# Altium project Kasli-DIOT.PrjPCB (part 5 of 7)

## Sheet FPGA_SDRAM.SchDoc: Kasli-DIOT
size 420 x 297 mm; EDA_Number: ARTIQ; Projet: ARTIQ/SINARA; Author: G.Kasprowicz; CompanyName: WUT ISE; DrawnBy: F.Świtakowski; Organization: WUT ISE; Address1: PW ISE; Address2: Nowowiejska 15/19 00-665 Warsaw; Address3: gkasprow@gmail.com; DocumentNumber: 1; Revision: 1.0; SheetNumber: 2; SheetTotal: 16; ModifiedBy: -; CheckedDate: -; Title2: FPGA_SDRAM; DivGrp: WUT ISE; Designer: F.Świtakowski; ModifiedDate: -; ProjectName: Sensor Box
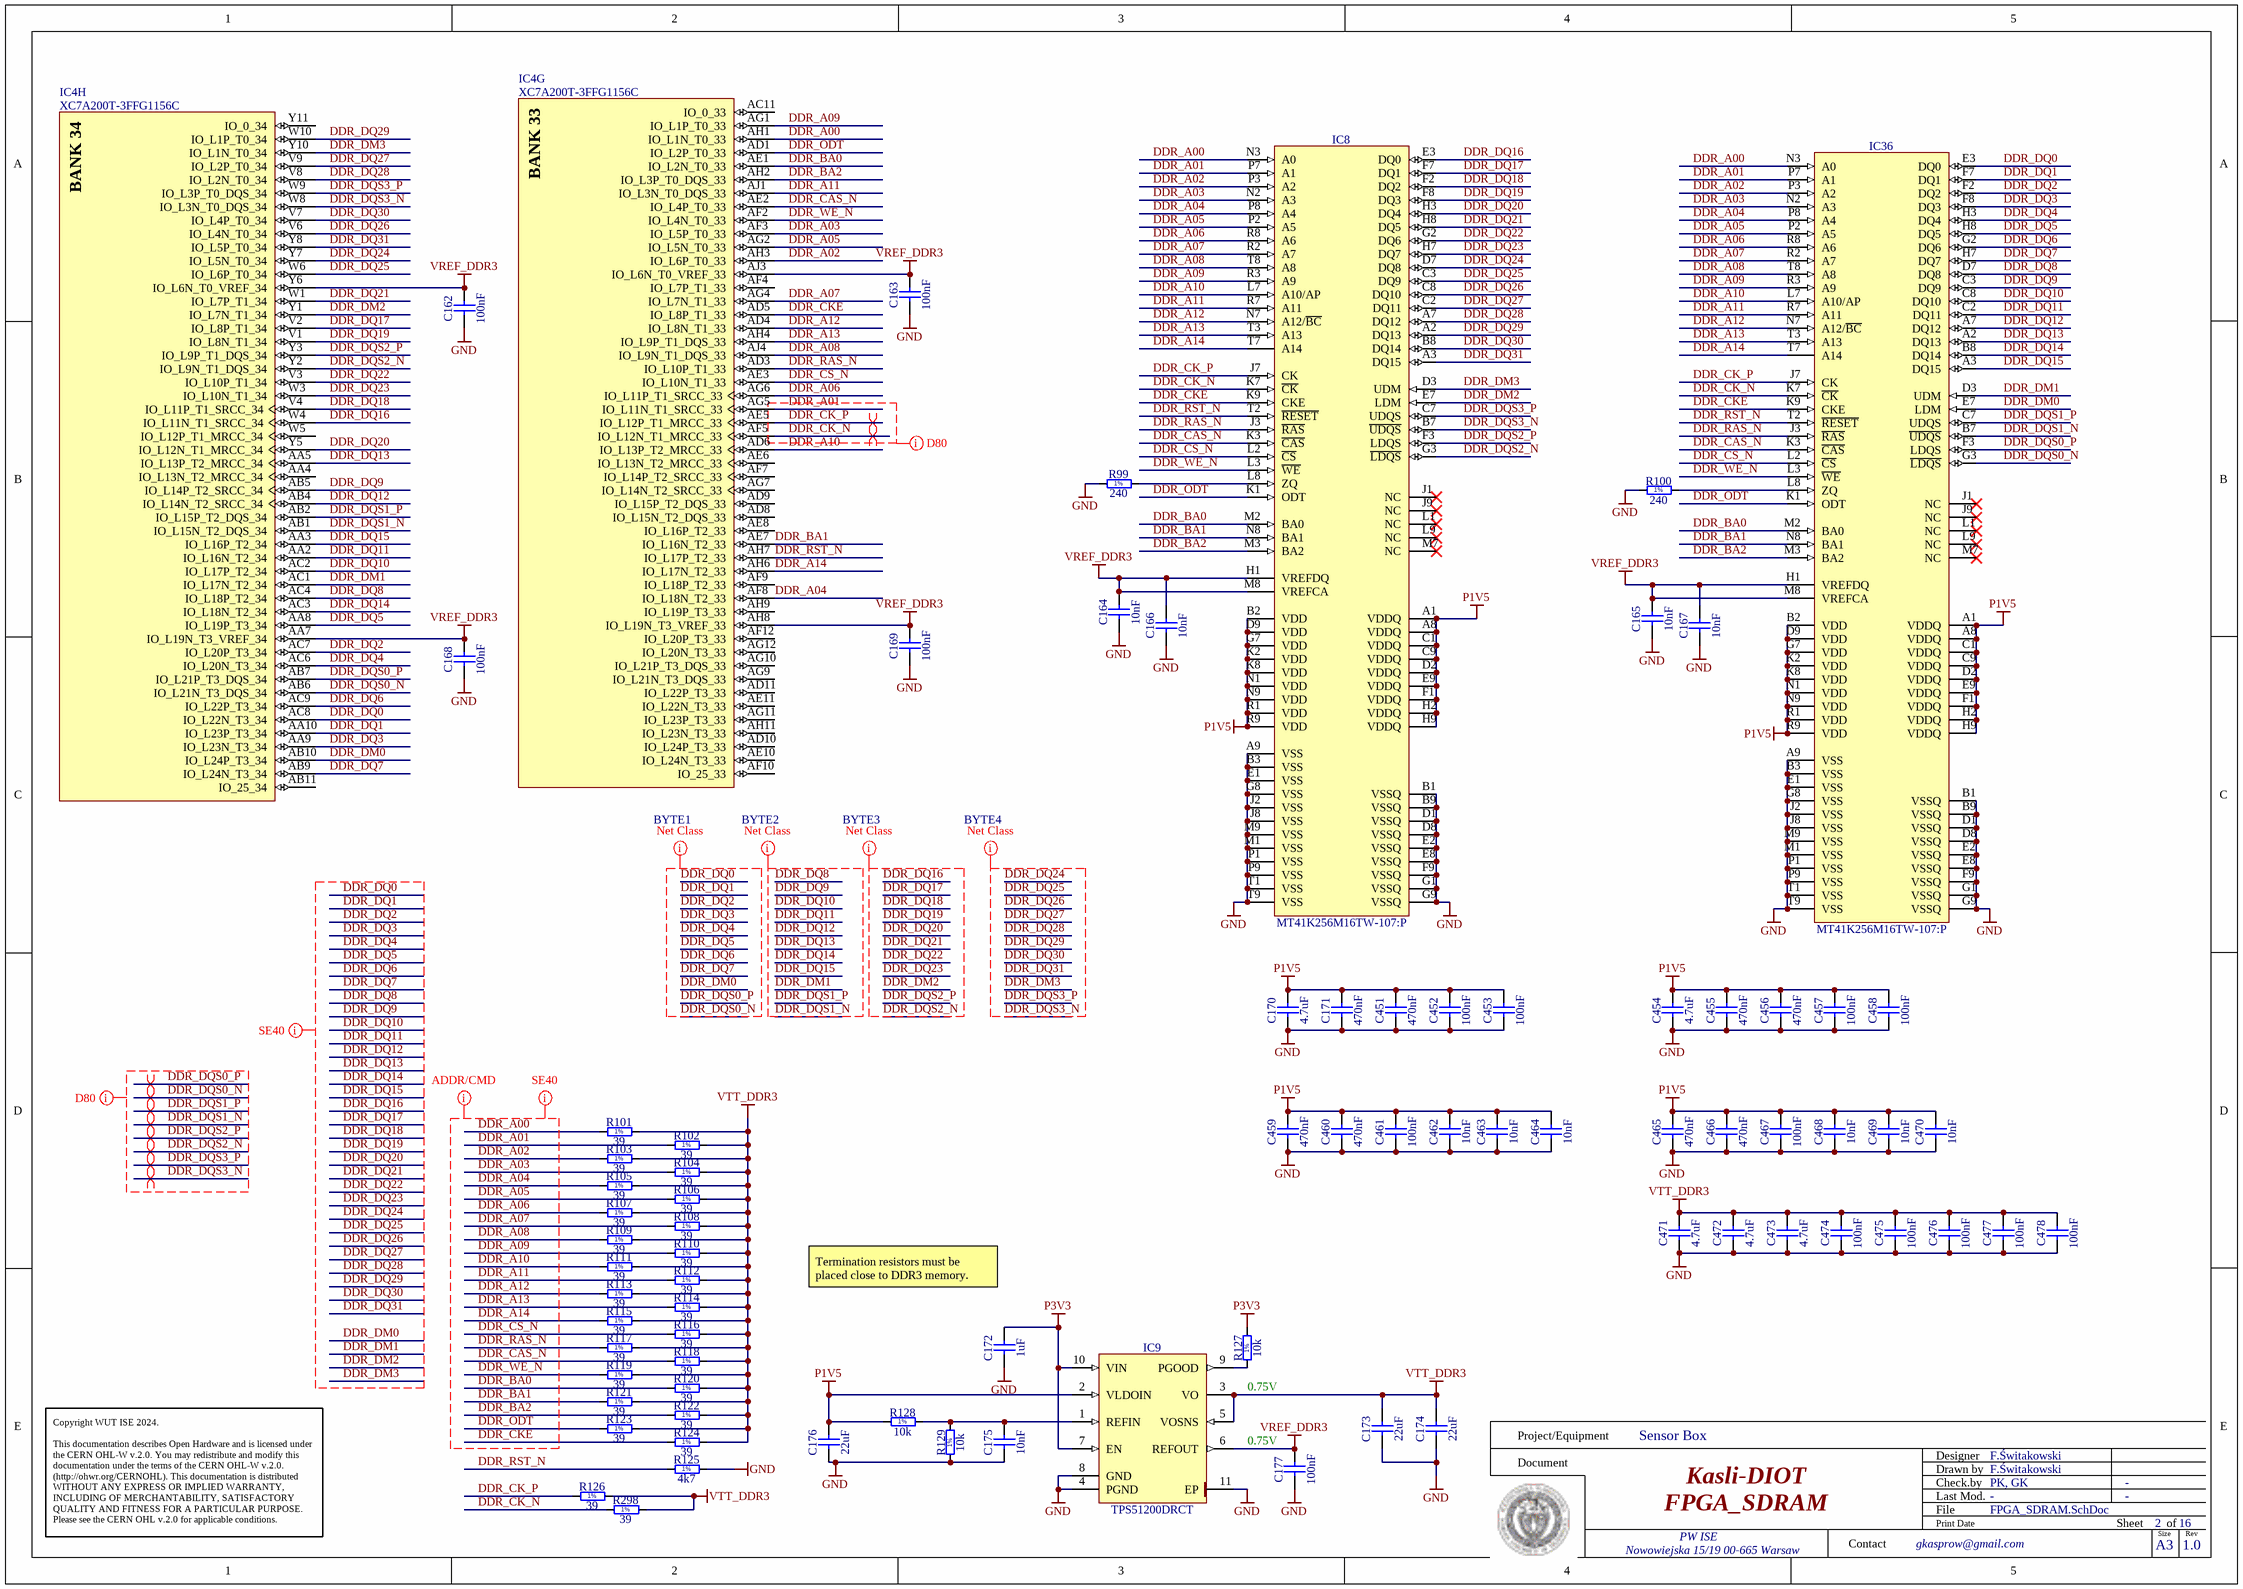
[diagram p6: FPGA_SDRAM.SchDoc]

### Parts
C162  100nF  [CAPC1005X55N]
C163  100nF  [CAPC1005X55N]
C164  10nF  [CAPC1005X55N]
C165  10nF  [CAPC1005X55N]
C166  10nF  [CAPC1005X55N]
C167  10nF  [CAPC1005X55N]
C168  100nF  [CAPC1005X55N]
C169  100nF  [CAPC1005X55N]
C170  4.7uF  [CAPC1005X55N]
C171  470nF  [CAPC1005X55N]
C172  1uF  [CAPC1005X55N]
C173  22uF  [CAPC1709X100N]
C174  22uF  [CAPC1709X100N]
C175  10nF  [CAPC1005X55N]
C176  22uF  [CAPC1709X100N]
C177  100nF  [CAPC1005X55N]
C451  470nF  [CAPC1005X55N]
C452  100nF  [CAPC1005X55N]
C453  100nF  [CAPC1005X55N]
C454  4.7uF  [CAPC1005X55N]
C455  470nF  [CAPC1005X55N]
C456  470nF  [CAPC1005X55N]
C457  100nF  [CAPC1005X55N]
C458  100nF  [CAPC1005X55N]
C459  470nF  [CAPC1005X55N]
C460  470nF  [CAPC1005X55N]
C461  100nF  [CAPC1005X55N]
C462  10nF  [CAPC1005X55N]
C463  10nF  [CAPC1005X55N]
C464  10nF  [CAPC1005X55N]
C465  470nF  [CAPC1005X55N]
C466  470nF  [CAPC1005X55N]
C467  100nF  [CAPC1005X55N]
C468  10nF  [CAPC1005X55N]
C469  10nF  [CAPC1005X55N]
C470  10nF  [CAPC1005X55N]
C471  4.7uF  [CAPC1005X55N]
C472  4.7uF  [CAPC1005X55N]
C473  4.7uF  [CAPC1005X55N]
C474  100nF  [CAPC1005X55N]
C475  100nF  [CAPC1005X55N]
C476  100nF  [CAPC1005X55N]
C477  100nF  [CAPC1005X55N]
C478  100nF  [CAPC1005X55N]
IC4  XC7A200T-3FFG1156C  [BGA1156C100P34X34_3500X3500X310]  (parts G,H of 18)
IC8  MT41K256M16TW-107:P  [BGA96C80P9X16_800X1400X120]
IC9  TPS51200DRCT  [TEXAS_DRC (S-PVSON-N10)]
IC36  MT41K256M16TW-107:P  [BGA96C80P9X16_800X1400X120]
R99  240  [RESC1005X40N]
R100  240  [RESC1005X40N]
R101  39  [RESC1005X40N]
R102  39  [RESC1005X40N]
R103  39  [RESC1005X40N]
R104  39  [RESC1005X40N]
R105  39  [RESC1005X40N]
R106  39  [RESC1005X40N]
R107  39  [RESC1005X40N]
R108  39  [RESC1005X40N]
R109  39  [RESC1005X40N]
R110  39  [RESC1005X40N]
R111  39  [RESC1005X40N]
R112  39  [RESC1005X40N]
R113  39  [RESC1005X40N]
R114  39  [RESC1005X40N]
R115  39  [RESC1005X40N]
R116  39  [RESC1005X40N]
R117  39  [RESC1005X40N]
R118  39  [RESC1005X40N]
R119  39  [RESC1005X40N]
R120  39  [RESC1005X40N]
R121  39  [RESC1005X40N]
R122  39  [RESC1005X40N]
R123  39  [RESC1005X40N]
R124  39  [RESC1005X40N]
R125  4k7  [RESC1005X40N]
R126  39  [RESC1005X40N]
R127  10k  [RESC1005X40N]
R128  10k  [RESC1005X40N]
R129  10k  [RESC1005X40N]
R298  39  [RESC1005X40N]

### Nets
GND: C162.1 C163.1 C164.1 C165.1 C166.1 C167.1 C168.1 C169.1 C170.1 C171.1 C172.1 C173.1 C174.1 C175.1 C176.1 C177.1 C451.1 C452.1 C453.1 C454.1 C455.1 C456.1 C457.1 C458.1 C459.1 C460.1 C461.1 C462.1 C463.1 C464.1 C465.1 C466.1 C467.1 C468.1 C469.1 C470.1 C471.1 C472.1 C473.1 C474.1 C475.1 C476.1 C477.1 C478.1 IC8.A9(VSS) IC8.B1(VSSQ) IC8.B3(VSS) IC8.B9(VSSQ) IC8.D1(VSSQ) IC8.D8(VSSQ) IC8.E1(VSS) IC8.E2(VSSQ) IC8.E8(VSSQ) IC8.F9(VSSQ) IC8.G1(VSSQ) IC8.G8(VSS) IC8.G9(VSSQ) IC8.J2(VSS) IC8.J8(VSS) IC8.M1(VSS) IC8.M9(VSS) IC8.P1(VSS) IC8.P9(VSS) IC8.T1(VSS) IC8.T9(VSS) IC9.4(PGND) IC9.8(GND) IC9.11(EP) IC36.A9(VSS) IC36.B1(VSSQ) IC36.B3(VSS) IC36.B9(VSSQ) IC36.D1(VSSQ) IC36.D8(VSSQ) IC36.E1(VSS) IC36.E2(VSSQ) IC36.E8(VSSQ) IC36.F9(VSSQ) IC36.G1(VSSQ) IC36.G8(VSS) IC36.G9(VSSQ) IC36.J2(VSS) IC36.J8(VSS) IC36.M1(VSS) IC36.M9(VSS) IC36.P1(VSS) IC36.P9(VSS) IC36.T1(VSS) IC36.T9(VSS) R99.1 R100.1 R125.2 R129.1
P1V5: C170.2 C171.2 C176.2 C451.2 C452.2 C453.2 C454.2 C455.2 C456.2 C457.2 C458.2 C459.2 C460.2 C461.2 C462.2 C463.2 C464.2 C465.2 C466.2 C467.2 C468.2 C469.2 C470.2 IC8.A1(VDDQ) IC8.A8(VDDQ) IC8.B2(VDD) IC8.C1(VDDQ) IC8.C9(VDDQ) IC8.D2(VDDQ) IC8.D9(VDD) IC8.E9(VDDQ) IC8.F1(VDDQ) IC8.G7(VDD) IC8.H2(VDDQ) IC8.H9(VDDQ) IC8.K2(VDD) IC8.K8(VDD) IC8.N1(VDD) IC8.N9(VDD) IC8.R1(VDD) IC8.R9(VDD) IC9.2(VLDOIN) IC36.A1(VDDQ) IC36.A8(VDDQ) IC36.B2(VDD) IC36.C1(VDDQ) IC36.C9(VDDQ) IC36.D2(VDDQ) IC36.D9(VDD) IC36.E9(VDDQ) IC36.F1(VDDQ) IC36.G7(VDD) IC36.H2(VDDQ) IC36.H9(VDDQ) IC36.K2(VDD) IC36.K8(VDD) IC36.N1(VDD) IC36.N9(VDD) IC36.R1(VDD) IC36.R9(VDD) R128.1
P3V3: C172.2 IC9.7(EN) IC9.10(VIN) R127.2
VREF_DDR3: C162.2 C163.2 C164.2 C165.2 C166.2 C167.2 C168.2 C169.2 C177.2 IC4.AA7(IO_L19N_T3_VREF_34) IC4.AH8(IO_L19N_T3_VREF_33) IC4.AJ3(IO_L6N_T0_VREF_33) IC4.Y6(IO_L6N_T0_VREF_34) IC8.H1(VREFDQ) IC8.M8(VREFCA) IC9.6(REFOUT) IC36.H1(VREFDQ) IC36.M8(VREFCA)
VTT_DDR3: C173.2 C174.2 C471.2 C472.2 C473.2 C474.2 C475.2 C476.2 C477.2 C478.2 IC9.3(VO) IC9.5(VOSNS) R101.2 R102.2 R103.2 R104.2 R105.2 R106.2 R107.2 R108.2 R109.2 R110.2 R111.2 R112.2 R113.2 R114.2 R115.2 R116.2 R117.2 R118.2 R119.2 R120.2 R121.2 R122.2 R123.2 R124.2 R126.2 R298.2
DDR_A00: IC4.AH1(IO_L1N_T0_33) IC8.N3(A0) IC36.N3(A0) R101.1
DDR_A01: IC4.AG5(IO_L11N_T1_SRCC_33) IC8.P7(A1) IC36.P7(A1) R102.1
DDR_A02: IC4.AH3(IO_L6P_T0_33) IC8.P3(A2) IC36.P3(A2) R103.1
DDR_A03: IC4.AF3(IO_L5P_T0_33) IC8.N2(A3) IC36.N2(A3) R104.1
DDR_A04: IC4.AF8(IO_L18N_T2_33) IC8.P8(A4) IC36.P8(A4) R105.1
DDR_A05: IC4.AG2(IO_L5N_T0_33) IC8.P2(A5) IC36.P2(A5) R106.1
DDR_A06: IC4.AG6(IO_L11P_T1_SRCC_33) IC8.R8(A6) IC36.R8(A6) R107.1
DDR_A07: IC4.AG4(IO_L7N_T1_33) IC8.R2(A7) IC36.R2(A7) R108.1
DDR_A08: IC4.AJ4(IO_L9N_T1_DQS_33) IC8.T8(A8) IC36.T8(A8) R109.1
DDR_A09: IC4.AG1(IO_L1P_T0_33) IC8.R3(A9) IC36.R3(A9) R110.1
DDR_A10: IC4.AD6(IO_L13P_T2_MRCC_33) IC8.L7(A10/AP) IC36.L7(A10/AP) R111.1
DDR_A11: IC4.AJ1(IO_L3N_T0_DQS_33) IC8.R7(A11) IC36.R7(A11) R112.1
DDR_A12: IC4.AD4(IO_L8N_T1_33) IC8.N7(A12/~{BC}) IC36.N7(A12/~{BC}) R113.1
DDR_A13: IC4.AH4(IO_L9P_T1_DQS_33) IC8.T3(A13) IC36.T3(A13) R114.1
DDR_A14: IC4.AH6(IO_L17N_T2_33) IC8.T7(A14) IC36.T7(A14) R115.1
DDR_BA0: IC4.AE1(IO_L2N_T0_33) IC8.M2(BA0) IC36.M2(BA0) R120.1
DDR_BA1: IC4.AE7(IO_L16N_T2_33) IC8.N8(BA1) IC36.N8(BA1) R121.1
DDR_BA2: IC4.AH2(IO_L3P_T0_DQS_33) IC8.M3(BA2) IC36.M3(BA2) R122.1
DDR_CAS_N: IC4.AE2(IO_L4P_T0_33) IC8.K3(~{CAS}) IC36.K3(~{CAS}) R118.1
DDR_CK_N: IC4.AF5(IO_L12N_T1_MRCC_33) IC8.K7(~{CK}) IC36.K7(~{CK}) R298.1
DDR_CK_P: IC4.AE5(IO_L12P_T1_MRCC_33) IC8.J7(CK) IC36.J7(CK) R126.1
DDR_CKE: IC4.AD5(IO_L8P_T1_33) IC8.K9(CKE) IC36.K9(CKE) R124.1
DDR_CS_N: IC4.AE3(IO_L10N_T1_33) IC8.L2(~{CS}) IC36.L2(~{CS}) R116.1
DDR_DM0: IC4.AB10(IO_L24P_T3_34) IC36.E7(LDM)
DDR_DM1: IC4.AC1(IO_L17N_T2_34) IC36.D3(UDM)
DDR_DM2: IC4.Y1(IO_L7N_T1_34) IC8.E7(LDM)
DDR_DM3: IC4.Y10(IO_L1N_T0_34) IC8.D3(UDM)
DDR_DQ0: IC4.AC8(IO_L22N_T3_34) IC36.E3(DQ0)
DDR_DQ1: IC4.AA10(IO_L23P_T3_34) IC36.F7(DQ1)
DDR_DQ2: IC4.AC7(IO_L20P_T3_34) IC36.F2(DQ2)
DDR_DQ3: IC4.AA9(IO_L23N_T3_34) IC36.F8(DQ3)
DDR_DQ4: IC4.AC6(IO_L20N_T3_34) IC36.H3(DQ4)
DDR_DQ5: IC4.AA8(IO_L19P_T3_34) IC36.H8(DQ5)
DDR_DQ6: IC4.AC9(IO_L22P_T3_34) IC36.G2(DQ6)
DDR_DQ7: IC4.AB9(IO_L24N_T3_34) IC36.H7(DQ7)
DDR_DQ8: IC4.AC4(IO_L18P_T2_34) IC36.D7(DQ8)
DDR_DQ9: IC4.AB5(IO_L14P_T2_SRCC_34) IC36.C3(DQ9)
DDR_DQ10: IC4.AC2(IO_L17P_T2_34) IC36.C8(DQ10)
DDR_DQ11: IC4.AA2(IO_L16N_T2_34) IC36.C2(DQ11)
DDR_DQ12: IC4.AB4(IO_L14N_T2_SRCC_34) IC36.A7(DQ12)
DDR_DQ13: IC4.AA5(IO_L13P_T2_MRCC_34) IC36.A2(DQ13)
DDR_DQ14: IC4.AC3(IO_L18N_T2_34) IC36.B8(DQ14)
DDR_DQ15: IC4.AA3(IO_L16P_T2_34) IC36.A3(DQ15)
DDR_DQ16: IC4.W4(IO_L11N_T1_SRCC_34) IC8.E3(DQ0)
DDR_DQ17: IC4.V2(IO_L8P_T1_34) IC8.F7(DQ1)
DDR_DQ18: IC4.V4(IO_L11P_T1_SRCC_34) IC8.F2(DQ2)
DDR_DQ19: IC4.V1(IO_L8N_T1_34) IC8.F8(DQ3)
DDR_DQ20: IC4.Y5(IO_L12N_T1_MRCC_34) IC8.H3(DQ4)
DDR_DQ21: IC4.W1(IO_L7P_T1_34) IC8.H8(DQ5)
DDR_DQ22: IC4.V3(IO_L10P_T1_34) IC8.G2(DQ6)
DDR_DQ23: IC4.W3(IO_L10N_T1_34) IC8.H7(DQ7)
DDR_DQ24: IC4.Y7(IO_L5N_T0_34) IC8.D7(DQ8)
DDR_DQ25: IC4.W6(IO_L6P_T0_34) IC8.C3(DQ9)
DDR_DQ26: IC4.V6(IO_L4N_T0_34) IC8.C8(DQ10)
DDR_DQ27: IC4.V9(IO_L2P_T0_34) IC8.C2(DQ11)
DDR_DQ28: IC4.V8(IO_L2N_T0_34) IC8.A7(DQ12)
DDR_DQ29: IC4.W10(IO_L1P_T0_34) IC8.A2(DQ13)
DDR_DQ30: IC4.V7(IO_L4P_T0_34) IC8.B8(DQ14)
DDR_DQ31: IC4.Y8(IO_L5P_T0_34) IC8.A3(DQ15)
DDR_DQS0_N: IC4.AB6(IO_L21N_T3_DQS_34) IC36.G3(~{LDQS})
DDR_DQS0_P: IC4.AB7(IO_L21P_T3_DQS_34) IC36.F3(LDQS)
DDR_DQS1_N: IC4.AB1(IO_L15N_T2_DQS_34) IC36.B7(~{UDQS})
DDR_DQS1_P: IC4.AB2(IO_L15P_T2_DQS_34) IC36.C7(UDQS)
DDR_DQS2_N: IC4.Y2(IO_L9N_T1_DQS_34) IC8.G3(~{LDQS})
DDR_DQS2_P: IC4.Y3(IO_L9P_T1_DQS_34) IC8.F3(LDQS)
DDR_DQS3_N: IC4.W8(IO_L3N_T0_DQS_34) IC8.B7(~{UDQS})
DDR_DQS3_P: IC4.W9(IO_L3P_T0_DQS_34) IC8.C7(UDQS)
DDR_ODT: IC4.AD1(IO_L2P_T0_33) IC8.K1(ODT) IC36.K1(ODT) R123.1
DDR_RAS_N: IC4.AD3(IO_L10P_T1_33) IC8.J3(~{RAS}) IC36.J3(~{RAS}) R117.1
DDR_RST_N: IC4.AH7(IO_L17P_T2_33) IC8.T2(~{RESET}) IC36.T2(~{RESET}) R125.1
DDR_WE_N: IC4.AF2(IO_L4N_T0_33) IC8.L3(~{WE}) IC36.L3(~{WE}) R119.1
NetC175_2: C175.2 IC9.1(REFIN) R128.2 R129.2
NetIC8_L8: IC8.L8(ZQ) R99.2
NetIC9_9: IC9.9(PGOOD) R127.1
NetIC36_L8: IC36.L8(ZQ) R100.2

Not connected (* = marked no-connect by the designer): IC4 AA4(IO_L13N_T2_MRCC_34) AB11(IO_25_34) AC11(IO_0_33) AD8(IO_L15N_T2_DQS_33) AD9(IO_L15P_T2_DQS_33) AD10(IO_L24P_T3_33) AD11(IO_L22P_T3_33) AE6(IO_L13N_T2_MRCC_33) AE8(IO_L16P_T2_33) AE10(IO_L24N_T3_33) AE11(IO_L22N_T3_33) AF4(IO_L7P_T1_33) AF7(IO_L14P_T2_SRCC_33) AF9(IO_L18P_T2_33) AF10(IO_25_33) AF12(IO_L20P_T3_33) AG7(IO_L14N_T2_SRCC_33) AG9(IO_L21N_T3_DQS_33) AG10(IO_L21P_T3_DQS_33) AG11(IO_L23P_T3_33) AG12(IO_L20N_T3_33) AH9(IO_L19P_T3_33) AH11(IO_L23N_T3_33) W5(IO_L12P_T1_MRCC_34) Y11(IO_0_34); IC8 J1(NC)* J9(NC)* L1(NC)* L9(NC)* M7(NC)*; IC36 J1(NC)* J9(NC)* L1(NC)* L9(NC)* M7(NC)*

### Layout directives
net class BYTE1: DDR_DM0, DDR_DQ0, DDR_DQ1, DDR_DQ2, DDR_DQ3, DDR_DQ4, DDR_DQ5, DDR_DQ6, DDR_DQ7, DDR_DQS0_N, DDR_DQS0_P
net class ADDR/CMD: DDR_A00, DDR_A01, DDR_A02, DDR_A03, DDR_A04, DDR_A05, DDR_A06, DDR_A07, DDR_A08, DDR_A09, DDR_A10, DDR_A11, DDR_A12, DDR_A13, DDR_A14, DDR_BA0, DDR_BA1, DDR_BA2, DDR_CAS_N, DDR_CKE, DDR_CS_N, DDR_ODT, DDR_RAS_N, DDR_WE_N
net class SE40: DDR_A00, DDR_A01, DDR_A02, DDR_A03, DDR_A04, DDR_A05, DDR_A06, DDR_A07, DDR_A08, DDR_A09, DDR_A10, DDR_A11, DDR_A12, DDR_A13, DDR_A14, DDR_BA0, DDR_BA1, DDR_BA2, DDR_CAS_N, DDR_CKE, DDR_CS_N, DDR_DM0, DDR_DM1, DDR_DM2, DDR_DM3, DDR_DQ0, DDR_DQ1, DDR_DQ2, DDR_DQ3, DDR_DQ4, DDR_DQ5, DDR_DQ6, DDR_DQ7, DDR_DQ8, DDR_DQ9, DDR_DQ10, DDR_DQ11, DDR_DQ12, DDR_DQ13, DDR_DQ14, DDR_DQ15, DDR_DQ16, DDR_DQ17, DDR_DQ18, DDR_DQ19, DDR_DQ20, DDR_DQ21, DDR_DQ22, DDR_DQ23, DDR_DQ24, DDR_DQ25, DDR_DQ26, DDR_DQ27, DDR_DQ28, DDR_DQ29, DDR_DQ30, DDR_DQ31, DDR_ODT, DDR_RAS_N, DDR_WE_N
differential pair: DDR_CK_N, DDR_CK_P, DDR_DQS0_N, DDR_DQS0_P, DDR_DQS1_N, DDR_DQS1_P, DDR_DQS2_N, DDR_DQS2_P, DDR_DQS3_N, DDR_DQS3_P
net class D80: DDR_A01, DDR_CK_N, DDR_CK_P, DDR_DQS0_N, DDR_DQS0_P, DDR_DQS1_N, DDR_DQS1_P, DDR_DQS2_N, DDR_DQS2_P, DDR_DQS3_N, DDR_DQS3_P
net class BYTE2: DDR_DM1, DDR_DQ8, DDR_DQ9, DDR_DQ10, DDR_DQ11, DDR_DQ12, DDR_DQ13, DDR_DQ14, DDR_DQ15, DDR_DQS1_N, DDR_DQS1_P
net class BYTE3: DDR_DM2, DDR_DQ16, DDR_DQ17, DDR_DQ18, DDR_DQ19, DDR_DQ20, DDR_DQ21, DDR_DQ22, DDR_DQ23, DDR_DQS2_N, DDR_DQS2_P
net class BYTE4: DDR_DM3, DDR_DQ24, DDR_DQ25, DDR_DQ26, DDR_DQ27, DDR_DQ28, DDR_DQ29, DDR_DQ30, DDR_DQ31, DDR_DQS3_N, DDR_DQS3_P

### Notes on the sheet
- Termination resistors must be placed close to DDR3 memory.
- (near R127) 0.75V
- (near C177) 0.75V
- Project/Equipment
- Document
- Designer
- Drawn by
- Check.by
- Copyright WUT ISE 2024.
  This documentation describes Open Hardware and is licensed under the CERN OHL-W v.2.0. You may redistribute and modify this documentation under the terms of the CERN OHL-W v.2.0. (http://ohwr.org/CERNOHL). This documentation is distributed WITHOUT ANY EXPRESS OR IMPLIED WARRANTY, INCLUDING OF MERCHANTABILITY, SATISFACTORY QUALITY AND FITNESS FOR A PARTICULAR PURPOSE. Please see the CERN OHL v.2.0 for applicable conditions.
- Contact
- File
- Last Mod.
- Print Date
- Sheet
- Size
- A3
- of
- Rev
- (in symbol R0402_4K7_1%_0.0625W_100PPM) 1%
- (in symbol R0402_10K_1%_0.0625W_100PPM) 1%
- (in symbol R0402_39R_1%_0.0625W_100PPM) 1%
- (in symbol R0402_240R_1%_0.0625W_100PPM) 1%
- (in symbol XC7A200T-3FFG1156C, part G) BANK 33
- (in symbol XC7A200T-3FFG1156C, part H) BANK 34

### Library data of the parts
C162 C163 C168 C169 C177 C452 C453 C457 C458 C461 C467 C474-C478 = CC0402_100NF_16V_10%_X7R: as C160 on sheet SFP; Part Number: CC0402_100NF_16V_10%_X7R; Component Kind: Standard; Component Type: Standard; Pin Count: 2; Value: 100nF; Status: Not Recommended; Manufacturer Part Number: CC0402_100NF_16V_10%_X7R; Case: 0402; Mounted: Yes; Socket: No; SMD: Yes; Sense: No; Manufacturer1 Example: MURATA; Manufacturer1 ComponentHeight: 0.55mm; HelpURL: \\cern.ch\dfs\Applications\Altium\Datasheets\CC0402_X7R_MURATA_GRM.pdf; Author: CERN DEM JLC; CreateDate: 05/12/2013; LatestRevisionDate: 03/12/2007
C164-C167 C175 C462-C464 C468-C470 = CC0402_10NF_16V_10%_X7R: Non-polarised capacitor; Part Description: SMD Multilayer Chip Ceramic Capacitor; Manufacturer: GENERIC; Manufacturer1 Part Number: 223878715636; Voltage: 16V; TC: X7R; Tolerance: ±10%; Part Number: CC0402_10NF_16V_10%_X7R; Component Kind: Standard; Component Type: Standard; Pin Count: 2; Value: 10nF; Status: Not Recommended; Manufacturer Part Number: CC0402_10NF_16V_10%_X7R; Case: 0402; Mounted: Yes; Socket: No; SMD: Yes; Sense: No; Manufacturer1 Example: PHYCOMP; Manufacturer1 ComponentHeight: 0.55mm; HelpURL: \\cern.ch\dfs\Applications\Altium\Datasheets\CC0402_X7R_PHYCOMP.pdf; Author: CERN DEM JLC; CreateDate: 03.12.2007; LatestRevisionDate: 03.12.2007
C170 C454 C471-C473 = CC0402_4.7UF_6.3V_20%_X5R: Non-polarised capacitor; Part Description: SMD Multilayer Chip Ceramic Capacitor; Manufacturer: GENERIC; Manufacturer1 Part Number: C1005X5R0J475M050BC; Voltage: 6.3V; TC: X5R; Tolerance: ±20%; Part Number: CC0402_4.7UF_6.3V_20%_X5R; Component Kind: Standard; Component Type: Standard; Pin Count: 2; Value: 4.7uF; Status: Preferred; Manufacturer Part Number: CC0402_4.7UF_6.3V_20%_X5R; Case: 0402; Mounted: Yes; Socket: No; SMD: Yes; Sense: No; Manufacturer1 Example: TDK; Manufacturer1 ComponentHeight: 0.65mm; HelpURL: \\cern.ch\dfs\Applications\Altium\Datasheets\CC0402_X5R_TDK_C.pdf; Author: CERN DEM JLC; CreateDate: 03/03/2015; LatestRevisionDate: 03/03/2015
C171 C451 C455 C456 C459 C460 C465 C466 = CC0402_470NF_16V_10%_X5R: Non-polarised capacitor; Part Description: SMD Multilayer Chip Ceramic Capacitor; Manufacturer: GENERIC; Manufacturer1 Part Number: C1005X5R1C105KT; Voltage: 16V; TC: X5R; Tolerance: ±10%; Part Number: CC0402_470NF_16V_10%_X5R; Component Kind: Standard; Component Type: Standard; Pin Count: 2; Value: 470nF; Status: Preferred; Manufacturer Part Number: CC0402_470NF_16V_10%_X5R; Case: 0402; Mounted: Yes; Socket: No; SMD: Yes; Sense: No; Manufacturer1 Example: TDK; Manufacturer1 ComponentHeight: 0.55mm; HelpURL: \\cern.ch\dfs\Applications\Altium\Datasheets\CC0402_X5R_TDK_C.pdf; Author: CERN DEM JLC; CreateDate: 10/25/2012; LatestRevisionDate: 10/25/2012
C172 = CC0402_1UF_16V_10%_X5R: Non-polarised capacitor; Part Description: SMD Multilayer Chip Ceramic Capacitor; Manufacturer: GENERIC; Manufacturer1 Part Number: C1005X5R1C105KT; Voltage: 16V; TC: X5R; Tolerance: ±10%; Part Number: CC0402_1UF_16V_10%_X5R; Component Kind: Standard; Component Type: Standard; Pin Count: 2; Value: 1uF; Status: Preferred; Manufacturer Part Number: CC0402_1UF_16V_10%_X5R; Case: 0402; Mounted: Yes; Socket: No; SMD: Yes; Manufacturer1 Example: TDK; Manufacturer1 ComponentHeight: 0.55mm; HelpURL: \\cern.ch\dfs\Applications\Altium\Datasheets\CC0402_X5R_TDK_C.pdf; Author: CERN DEM JLC; CreateDate: 25.10.2012; LatestRevisionDate: 25.10.2012; Sense: No
C173 C174 C176 = CC0603_22UF_6.3V_20%_X5R: Non-polarised capacitor; Part Description: SMD Multilayer Chip Ceramic Capacitor; Manufacturer: GENERIC; Manufacturer1 Part Number: C1608X5R0J226M080AC; Voltage: 6.3V; TC: X5R; Tolerance: ±20%; Part Number: CC0603_22UF_6.3V_20%_X5R; Component Kind: Standard; Component Type: Standard; Pin Count: 2; Value: 22uF; Status: None; Manufacturer Part Number: CC0603_22UF_6.3V_20%_X5R; Case: 0603; Mounted: Yes; Socket: No; SMD: Yes; Manufacturer1 Example: TDK; Manufacturer1 ComponentHeight: 1mm; HelpURL: \\cern.ch\dfs\Applications\Altium\Datasheets\CC0603_X5R_TDK_C.pdf; Author: CERN DEM JLC; CreateDate: 16.12.2013; LatestRevisionDate: 13.09.2016; Sense: No
IC4 = XC7A200T-3FFG1156C: Artix-7 FPGA, 500 User I/Os, 16 GTP, 1156-Ball BGA, , Speed Grade 3, Commercial Grade, Pb-Free; Part Description: Artix-7 FPGA, 500 User I/Os, 16 GTP, 1156-Ball BGA, Speed Grade 3, Commercial Grade, Pb-Free; Manufacturer: XILINX; PressFit: No; Bonding: No; Part Number: XC7A200T-3FFG1156C; Component Kind: Standard; Component Type: Standard; Device: XC7A200T-3FFG1156C; PackageDescription: BGA, 1.00mm Pitch, Square; 1156 Pin, 34 Columns X 34 Rows, Body 35.00mm X 35.0mm X 3.10mm H, IPC Medium Density; Manufacturer Part Number: XC7A200T-3FFG1156C; Pin Count: 1156; Case: BGA1156; Mounted: Yes; Socket: No; SMD: Yes; Sense: No; ComponentHeight: 3.1mm; HelpURL: \\cern.ch\dfs\Applications\Altium\Datasheets\XC7A200T-3FFG1156C.pdf; ComponentLink1URL: \\cern.ch\dfs\Applications\Altium\Datasheets\XC7A200T-3FFG1156C_Package.pdf; ComponentLink1Description: Package; ComponentLink2URL: \\cern.ch\dfs\Applications\Altium\Datasheets\XC7A200T-3FFG1156C_Pinout.txt; ComponentLink2Description: Pinout; Author: CERN DEM JLC; CreateDate: 07.11.2016; LatestRevisionDate: 07.11.2016
IC8 IC36 = MT41K256M16TW-107:P: 32 Meg x 16 x 8 Banks DDR3L SDRAM; Part Description: +1.5V, 4Gb (32Meg x 16 x 8 banks) DDR3L SDRAM; Manufacturer: MICRON TECHNOLOGY; PressFit: No; Bonding: No; Part Number: MT41K256M16TW-107:P; Component Kind: Standard; Component Type: Standard; Device: MT41K256M16TW-107:P; PackageDescription: BGA 0.8mm, Pitch, Square 96 Pin, 9 Columns x 16 Rows, Body 14mm X 8mm X 1.2mm H; Manufacturer Part Number: MT41K256M16TW-107:P; Pin Count: 96; Case: BGA96; Mounted: Yes; Socket: No; SMD: Yes; Sense: No; ComponentHeight: 1.2mm; HelpURL: \\cern.ch\dfs\Applications\Altium\Datasheets\MT41K256M16TW-107-P.pdf; Author: CERN DEM MR; CreateDate: 2015-12-14; LatestRevisionDate: 2015-12-14
IC9 = TPS51200DRCT: Sink/Source DDR Termination Regulator; Part Description: 3.3V Sink/Source DDR Termination Regulator; Manufacturer: TEXAS INSTRUMENTS; PressFit: No; Bonding: No; Part Number: TPS51200DRCT; Component Kind: Standard; Component Type: Standard; Device: TPS51200DRCT; PackageDescription: SON, 0.50mm Pitch, 10-pin, 3.00mm W  X 3.00mm L X 1.00mm Height, (w/thermal tab 1.75 X 2.50 mm); Manufacturer Part Number: TPS51200DRCT; Pin Count: 11; Case: SON10; Mounted: Yes; Socket: No; SMD: Yes; Sense: No; ComponentHeight: 1mm; HelpURL: \\cern.ch\dfs\Applications\Altium\Datasheets\TPS51200DRCT.pdf; Author: CERN DEM JLC; CreateDate: 03.02.2010; LatestRevisionDate: 06.11.2013
R99 R100 = R0402_240R_1%_0.0625W_100PPM: Resistor - 1%; Part Description: General Purpose Thick Film Chip Resistor; Manufacturer: GENERIC; Manufacturer1 Part Number: 232270672401L; TC: ±100ppm/°C; PressFit: No; Part Number: R0402_240R_1%_0.0625W_100PPM; Component Kind: Standard; Component Type: Standard; Pin Count: 2; Value: 240; Status: Not Recommended; Power: 0.0625W; Tolerance: ±1%; Manufacturer Part Number: R0402_240R_1%_0.0625W_100PPM; Case: 0402; Mounted: Yes; Sense: No; Socket: No; SMD: Yes; Manufacturer1 Example: YAGEO PHYCOMP; Manufacturer1 ComponentHeight: 0.4mm; HelpURL: \\cern.ch\dfs\Applications\Altium\Datasheets\R0402_Phycomp_RC0402.pdf; Author: CERN DEM JLC; CreateDate: 12/3/2007; LatestRevisionDate: 10/17/2012
R101-R124 R126 R298 = R0402_39R_1%_0.0625W_100PPM: Resistor - 1%; Part Description: General Purpose Thick Film Chip Resistor; Manufacturer: GENERIC; Manufacturer1 Part Number: 232270673909L; TC: ±100ppm/°C; PressFit: No; Part Number: R0402_39R_1%_0.0625W_100PPM; Component Kind: Standard; Component Type: Standard; Pin Count: 2; Value: 39; Status: Not Recommended; Power: 0.0625W; Tolerance: ±1%; Manufacturer Part Number: R0402_39R_1%_0.0625W_100PPM; Case: 0402; Mounted: Yes; Sense: No; Socket: No; SMD: Yes; Manufacturer1 Example: YAGEO PHYCOMP; Manufacturer1 ComponentHeight: 0.4mm; HelpURL: \\cern.ch\dfs\Applications\Altium\Datasheets\R0402_Phycomp_RC0402.pdf; Author: CERN DEM JLC; CreateDate: 03.12.2007; LatestRevisionDate: 17.10.2012
R125 = R0402_4K7_1%_0.0625W_100PPM: Resistor - 1%; Part Description: General Purpose Thick Film Chip Resistor; Manufacturer: GENERIC; Manufacturer1 Part Number: 232270674702L; TC: ±100ppm/°C; PressFit: No; Part Number: R0402_4K7_1%_0.0625W_100PPM; Component Kind: Standard; Component Type: Standard; Pin Count: 2; Value: 4k7; Status: Not Recommended; Power: 0.0625W; Tolerance: ±1%; Manufacturer Part Number: R0402_4K7_1%_0.0625W_100PPM; Case: 0402; Mounted: Yes; Sense: No; Socket: No; SMD: Yes; Manufacturer1 Example: YAGEO PHYCOMP; Manufacturer1 ComponentHeight: 0.4mm; HelpURL: \\cern.ch\dfs\Applications\Altium\Datasheets\R0402_Phycomp_RC0402.pdf; Author: CERN DEM JLC; CreateDate: 03.12.2007; LatestRevisionDate: 17.10.2012
R127-R129 = R0402_10K_1%_0.0625W_100PPM: as R130 on sheet SFP; Part Number: R0402_10K_1%_0.0625W_100PPM; Component Kind: Standard; Component Type: Standard; Pin Count: 2; Value: 10k; Status: Not Recommended; Power: 0.0625W; Tolerance: ±1%; Manufacturer Part Number: R0402_10K_1%_0.0625W_100PPM; Case: 0402; Mounted: Yes; Socket: No; SMD: Yes; Manufacturer1 Example: YAGEO PHYCOMP; Manufacturer1 ComponentHeight: 0.4mm; HelpURL: \\cern.ch\dfs\Applications\Altium\Datasheets\R0402_Phycomp_RC0402.pdf; Author: CERN DEM JLC; CreateDate: 03.12.2007; LatestRevisionDate: 17.10.2012; Sense: No

## Sheet USB_Serial_Quad.SchDoc: Kasli-DIOT
size 420 x 297 mm; EDA_Number: ARTIQ; Projet: ARTIQ/SINARA; Author: G.Kasprowicz; CompanyName: WUT ISE; DrawnBy: F.Świtakowski; Organization: WUT ISE; Address1: PW ISE; Address2: Nowowiejska 15/19 00-665 Warsaw; Address3: gkasprow@gmail.com; DocumentNumber: 9; Revision: 1.0; SheetNumber: 9; SheetTotal: 16; ModifiedBy: -; CheckedDate: -; Title2: USB_Serial_Quad; DivGrp: WUT ISE; Designer: F.Świtakowski; ModifiedDate: -; ProjectName: Sensor Box
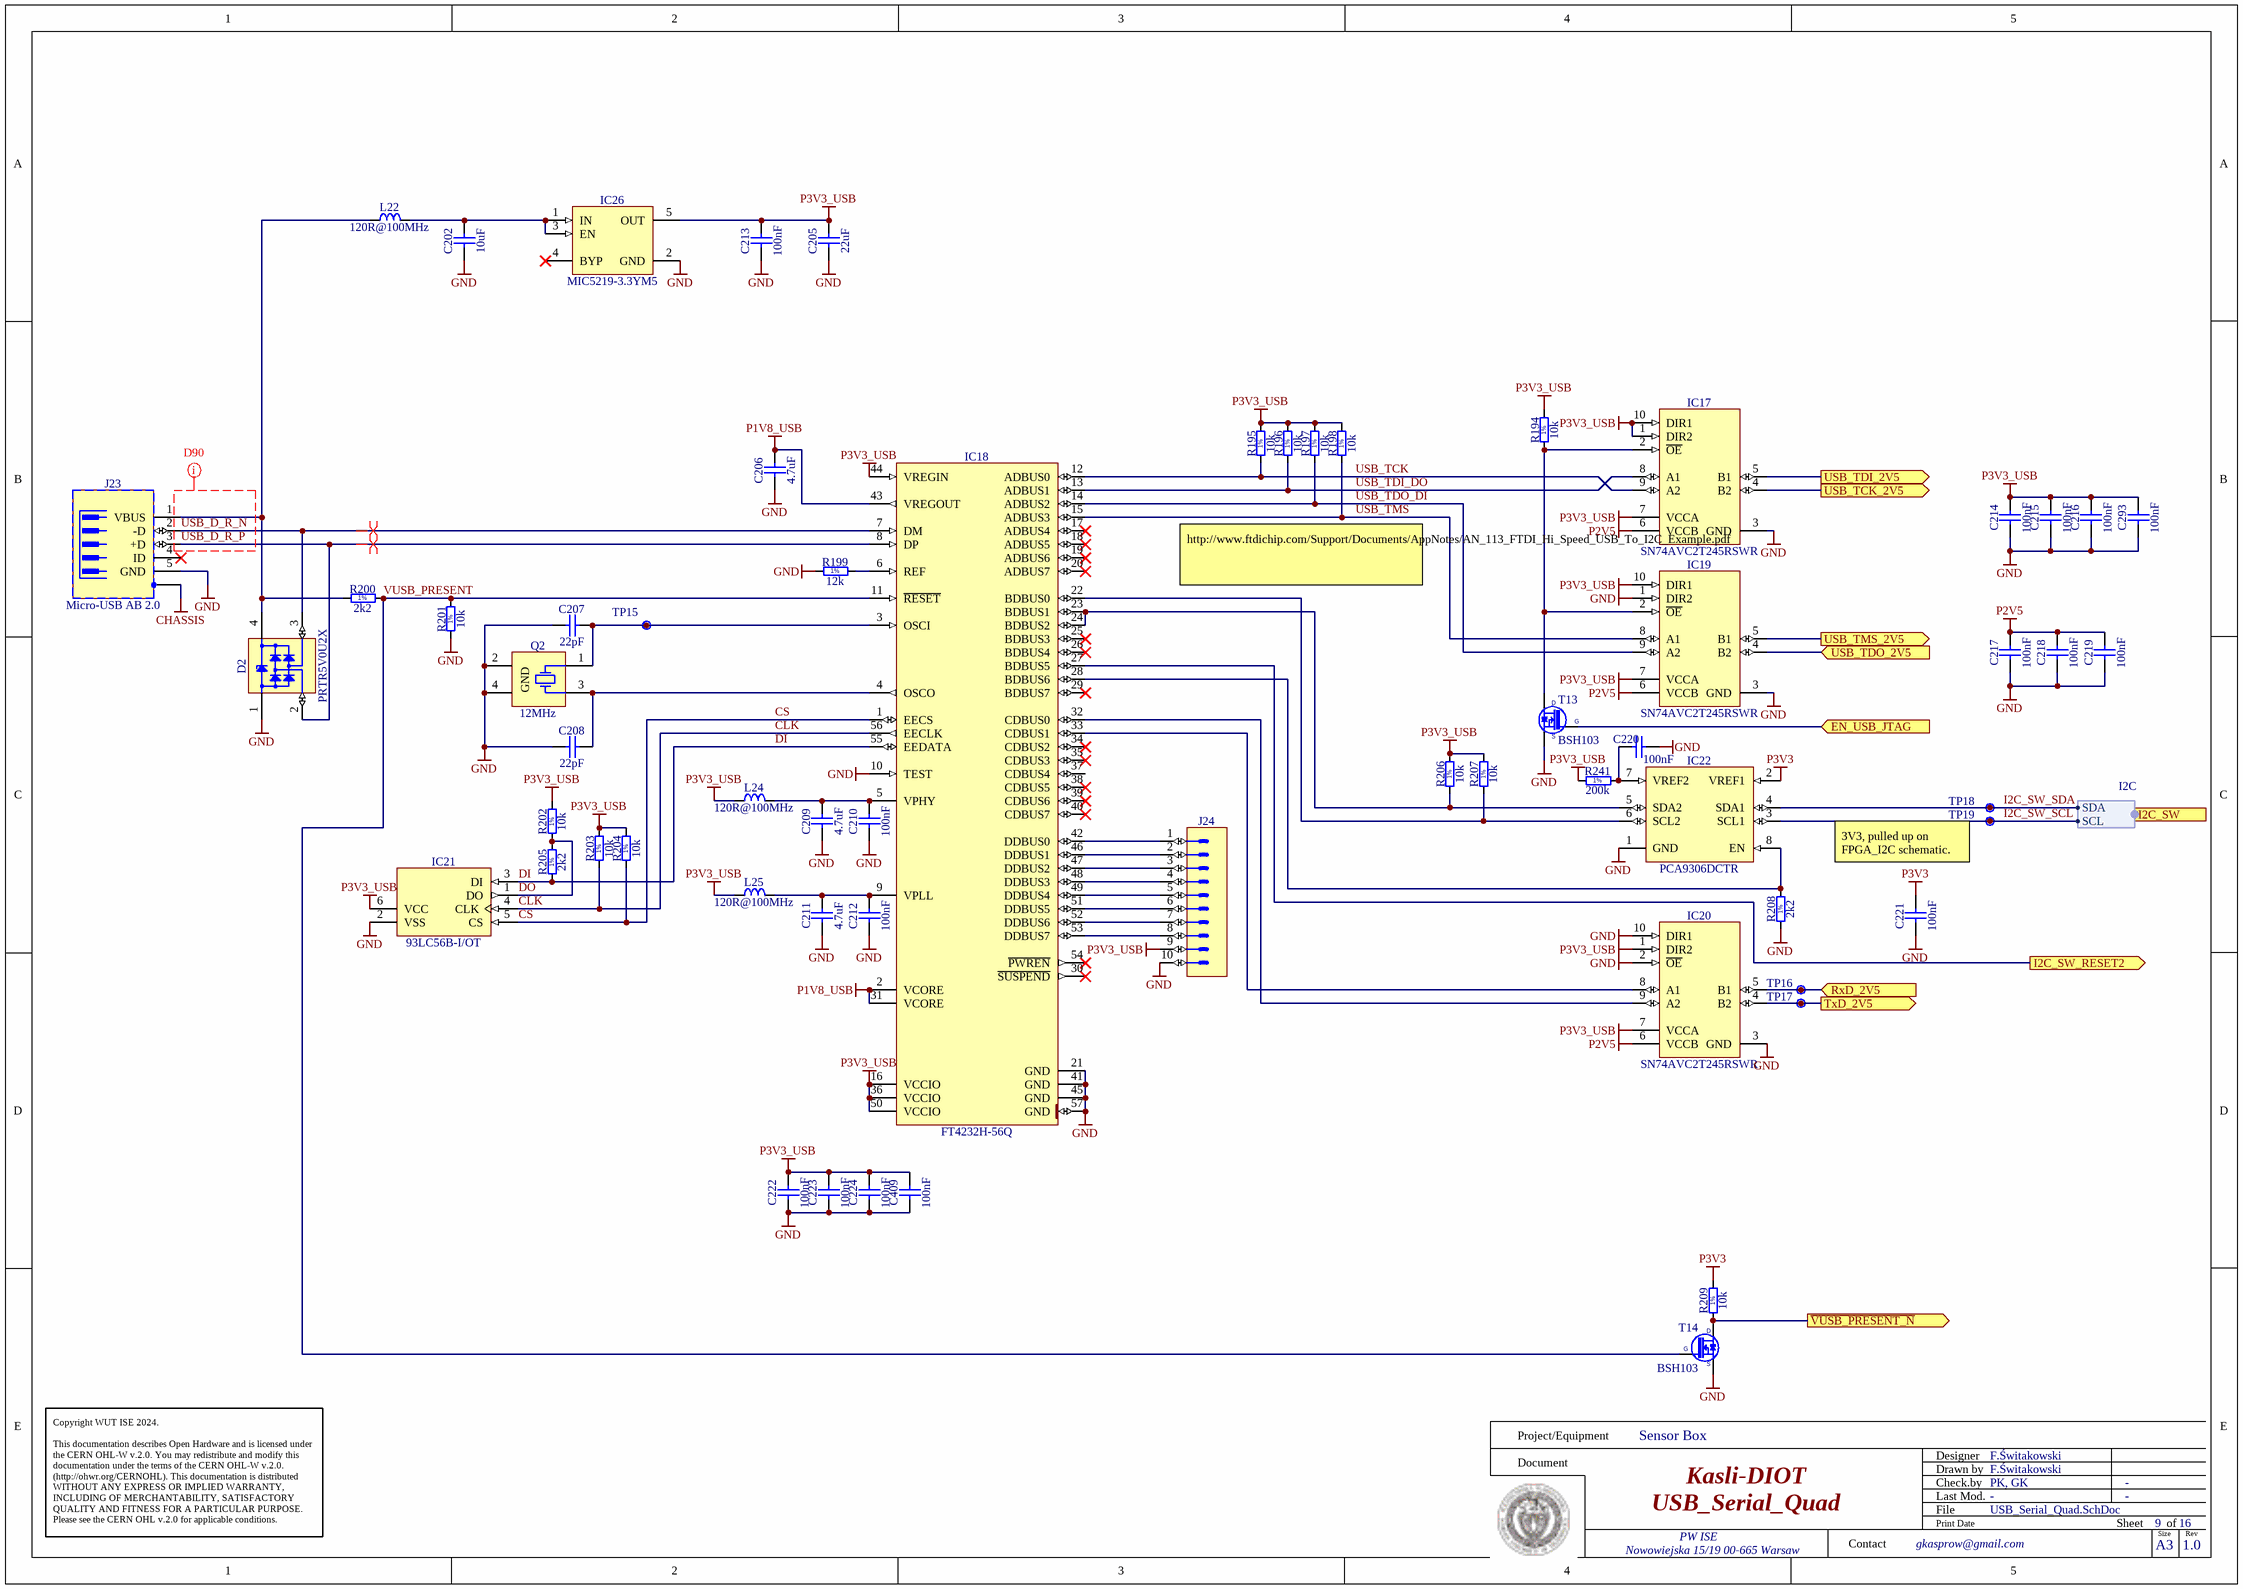
[diagram p7: USB_Serial_Quad.SchDoc]

### Parts
C202  10uF  [CAPC1608X87N]
C205  22uF  [CAPC1709X100N]
C206  4.7uF  [CAPC2012X135N]
C207  22pF  [CAPC1005X55N]
C208  22pF  [CAPC1005X55N]
C209  4.7uF  [CAPC2012X135N]
C210  100nF  [CAPC0603X33N]
C211  4.7uF  [CAPC2012X135N]
C212  100nF  [CAPC0603X33N]
C213  100nF  [CAPC1005X55N]
C214  100nF  [CAPC1005X55N]
C215  100nF  [CAPC1005X55N]
C216  100nF  [CAPC1005X55N]
C217  100nF  [CAPC1005X55N]
C218  100nF  [CAPC1005X55N]
C219  100nF  [CAPC1005X55N]
C220  100nF  [CAPC1005X55N]
C221  100nF  [CAPC1005X55N]
C222  100nF  [CAPC1005X55N]
C223  100nF  [CAPC1005X55N]
C224  100nF  [CAPC1005X55N]
C293  100nF  [CAPC1005X55N]
C409  100nF  [CAPC1005X55N]
D2  PRTR5V0U2X  [SOT190P230X110-4N]
IC17  SN74AVC2T245RSWR  [QFN40P140X180X55-10N]
IC18  FT4232H-56Q  [QFN50P800X800X100-57N-S620]
IC19  SN74AVC2T245RSWR  [QFN40P140X180X55-10N]
IC20  SN74AVC2T245RSWR  [QFN40P140X180X55-10N]
IC21  93LC56B-I/OT  [SOT95P270X145-6N]
IC22  PCA9306DCTR  [SOP65P400X130-8N]
IC26  MIC5219-3.3YM5  [SOT95P280X145-5N]
J23  Micro-USB AB 2.0  [HIROSE_ZX62RD-AB-5P8]
J24  Header 10  [SAMTEC_TSW-105-07-L-D-LL]  (value not drawn)
L22  120R@100MHz  [INDC1608X65N]
L24  120R@100MHz  [INDC1608X65N]
L25  120R@100MHz  [INDC1608X65N]
Q2  12MHz  [XTAL_TXC_7M]
R194  10k  [RESC1005X40N]
R195  10k  [RESC1005X40N]
R196  10k  [RESC1005X40N]
R197  10k  [RESC1005X40N]
R198  10k  [RESC1005X40N]
R199  12k  [RESC1005X40N]
R200  2k2  [RESC1005X40N]
R201  10k  [RESC1005X40N]
R202  10k  [RESC1005X40N]
R203  10k  [RESC1005X40N]
R204  10k  [RESC1005X40N]
R205  2k2  [RESC1005X40N]
R206  10k  [RESC1005X40N]
R207  10k  [RESC1005X40N]
R208  2k2  [RESC1005X40N]
R209  10k  [RESC1005X40N]
R241  200k  [RESC1005X40N]
T13  BSH103  [SOT95P230X110-3N]
T14  BSH103  [SOT95P230X110-3N]
TP15  Test Point  [TPS127]  (value not drawn)  (no BOM)
TP16  Test Point  [TPS127]  (value not drawn)  (no BOM)
TP17  Test Point  [TPS127]  (value not drawn)  (no BOM)
TP18  Test Point  [TPS127]  (value not drawn)  (no BOM)
TP19  Test Point  [TPS127]  (value not drawn)  (no BOM)

### Ports
EN_USB_JTAG (in), I2C_SW (harness i2C), I2C_SW_RESET2 (out), RxD_2V5 (in), TxD_2V5 (out), USB_TCK_2V5 (out), USB_TDI_2V5 (out), USB_TDO_2V5 (in), USB_TMS_2V5 (out), ~{VUSB_PRESENT_N} (out)

### Harnesses
I2C: SDA, SCL

### Nets
CHASSIS: J23.6(SH)  [project net STRIP3]
GND: C202.1 C205.1 C206.1 C207.1 C208.1 C209.1 C210.1 C211.1 C212.1 C213.1 C214.1 C215.1 C216.1 C217.1 C218.1 C219.1 C220.2 C221.1 C222.1 C223.1 C224.1 C293.1 C409.1 D2.1(GND) IC17.3(GND) IC18.10(TEST) IC18.21(GND) IC18.41(GND) IC18.45(GND) IC18.57(GND) IC19.1(DIR2) IC19.3(GND) IC20.2(~{OE}) IC20.3(GND) IC20.10(DIR1) IC21.2(VSS) IC22.1(GND) IC26.2(GND) J23.5(GND) J24.10 Q2.2(GND) Q2.4(GND) R199.1 R201.1 R208.1 T13.2(S) T14.2(S)
P1V8_USB: C206.2 IC18.2(VCORE) IC18.31(VCORE) IC18.43(VREGOUT)
P2V5: C217.2 C218.2 C219.2 IC17.6(VCCB) IC19.6(VCCB) IC20.6(VCCB)
P3V3: C221.2 IC22.2(VREF1) R209.2
P3V3_USB: C205.2 C213.2 C214.2 C215.2 C216.2 C222.2 C223.2 C224.2 C293.2 C409.2 IC17.1(DIR2) IC17.7(VCCA) IC17.10(DIR1) IC18.16(VCCIO) IC18.36(VCCIO) IC18.44(VREGIN) IC18.50(VCCIO) IC19.7(VCCA) IC19.10(DIR1) IC20.1(DIR2) IC20.7(VCCA) IC21.6(VCC) IC26.5(OUT) J24.9 L24.1 L25.1 R194.2 R195.2 R196.2 R197.2 R198.2 R202.2 R203.2 R204.2 R206.2 R207.2 R241.1
~{VUSB_PRESENT_N}: R209.1 T14.3(D) ; port ~{VUSB_PRESENT_N}
CLK: IC18.56(EECLK) IC21.4(CLK) R203.1
CS: IC18.1(EECS) IC21.5(CS) R204.1
DI: IC18.55(EEDATA) IC21.3(DI) R205.2
DO: IC21.1(DO) R202.1 R205.1
I2C_SW_RESET2: IC18.27(BDBUS5) ; port I2C_SW_RESET2
I2C_SW_SCL: IC22.3(SCL1) TP19.1 ; port I2C_SW.SCL
I2C_SW_SDA: IC22.4(SDA1) TP18.1 ; port I2C_SW.SDA
RxD_2V5: IC20.5(B1) TP16.1 ; port RxD_2V5
TxD_2V5: IC20.4(B2) TP17.1 ; port TxD_2V5
USB_D_R_N: D2.3(I/O2) IC18.7(DM) J23.2(-D)
USB_D_R_P: D2.2(I/O1) IC18.8(DP) J23.3(+D)
USB_TCK: IC17.9(A2) IC18.12(ADBUS0) R195.1
USB_TDI_DO: IC17.8(A1) IC18.13(ADBUS1) R196.1
USB_TDO_DI: IC18.14(ADBUS2) IC19.9(A2) R197.1
USB_TMS: IC18.15(ADBUS3) IC19.8(A1) R198.1
VUSB_PRESENT: IC18.11(~{RESET}) R200.2 R201.2 T14.1(G)
NetC202_2: C202.2 IC26.1(IN) IC26.3(EN) L22.2
NetC207_2: C207.2 IC18.3(OSCI) Q2.1(X) TP15.1
NetC208_2: C208.2 IC18.4(OSCO) Q2.3(X)
NetC209_2: C209.2 C210.2 IC18.5(VPHY) L24.2
NetC211_2: C211.2 C212.2 IC18.9(VPLL) L25.2
NetC220_1: C220.1 IC22.7(VREF2) R241.2
NetD2_4: D2.4(VCC) J23.1(VBUS) L22.1 R200.1
NetIC17_2: IC17.2(~{OE}) IC19.2(~{OE}) R194.1 T13.3(D)
NetIC17_4: IC17.4(B2) ; port USB_TCK_2V5
NetIC17_5: IC17.5(B1) ; port USB_TDI_2V5
NetIC18_6: IC18.6(REF) R199.2
NetIC18_22: IC18.22(BDBUS0) IC22.6(SCL2) R207.1
NetIC18_23: IC18.23(BDBUS1) IC18.24(BDBUS2) IC22.5(SDA2) R206.1
NetIC18_28: IC18.28(BDBUS6) IC22.8(EN) R208.2
NetIC18_32: IC18.32(CDBUS0) IC20.9(A2)
NetIC18_33: IC18.33(CDBUS1) IC20.8(A1)
NetIC18_42: IC18.42(DDBUS0) J24.1
NetIC18_46: IC18.46(DDBUS1) J24.2
NetIC18_47: IC18.47(DDBUS2) J24.3
NetIC18_48: IC18.48(DDBUS3) J24.4
NetIC18_49: IC18.49(DDBUS4) J24.5
NetIC18_51: IC18.51(DDBUS5) J24.6
NetIC18_52: IC18.52(DDBUS6) J24.7
NetIC18_53: IC18.53(DDBUS7) J24.8
NetIC19_4: IC19.4(B2) ; port USB_TDO_2V5
NetIC19_5: IC19.5(B1) ; port USB_TMS_2V5
NetT13_1: T13.1(G) ; port EN_USB_JTAG

Not connected (* = marked no-connect by the designer): IC18 17(ADBUS4)* 18(ADBUS5)* 19(ADBUS6)* 20(ADBUS7)* 25(BDBUS3)* 26(BDBUS4)* 29(BDBUS7)* 30(~{SUSPEND})* 34(CDBUS2)* 35(CDBUS3)* 37(CDBUS4) 38(CDBUS5)* 39(CDBUS6)* 40(CDBUS7)* 54(~{PWREN})*; IC26 4(BYP)*; J23 4(ID)*

### Layout directives
net class D90: USB_D_R_N, USB_D_R_P
differential pair: USB_D_R_N, USB_D_R_P

### Notes on the sheet
- http://www.ftdichip.com/Support/Documents/AppNotes/AN_113_FTDI_Hi_Speed_USB_To_I2C_Example.pdf
- 3V3, pulled up on FPGA_I2C schematic.
- Project/Equipment
- Document
- Designer
- Drawn by
- Check.by
- Copyright WUT ISE 2024.
  This documentation describes Open Hardware and is licensed under the CERN OHL-W v.2.0. You may redistribute and modify this documentation under the terms of the CERN OHL-W v.2.0. (http://ohwr.org/CERNOHL). This documentation is distributed WITHOUT ANY EXPRESS OR IMPLIED WARRANTY, INCLUDING OF MERCHANTABILITY, SATISFACTORY QUALITY AND FITNESS FOR A PARTICULAR PURPOSE. Please see the CERN OHL v.2.0 for applicable conditions.
- Contact
- File
- Last Mod.
- Print Date
- Sheet
- Size
- A3
- of
- Rev
- (in symbol R0402_2K2_1%_0.0625W_100PPM) 1%
- (in symbol R0402_10K_1%_0.0625W_100PPM) 1%
- (in symbol R0402_12K_1%_0.0625W_100PPM) 1%
- (in symbol R0402_200K_1%_0.0625W_100PPM) 1%

### Library data of the parts
C202 = CC0603_10UF_6.3V_20%_X5R: Non-polarised capacitor; Part Description: SMD Multilayer Chip Ceramic Capacitor; Manufacturer: GENERIC; Manufacturer1 Part Number: C0603C106M9PAC; Voltage: 6.3V; TC: X5R; Tolerance: ±20%; Part Number: CC0603_10UF_6.3V_20%_X5R; Component Kind: Standard; Component Type: Standard; Pin Count: 2; Value: 10uF; Status: Preferred; Manufacturer Part Number: CC0603_10uF_6.3V_20%_X5R; Case: 0603; Mounted: Yes; Socket: No; SMD: Yes; Sense: No; Manufacturer1 Example: KEMET; Manufacturer1 ComponentHeight: 0.95mm; HelpURL: \\cern.ch\dfs\Applications\Altium\Datasheets\CC0603_X5R_KEMET.pdf; Author: CERN DEM JLC; CreateDate: 2007-12-03; LatestRevisionDate: 2007-12-03
C205 = CC0603_22UF_6.3V_20%_X5R: Non-polarised capacitor; Part Description: SMD Multilayer Chip Ceramic Capacitor; Manufacturer: GENERIC; Manufacturer1 Part Number: C1608X5R0J226M080AC; Voltage: 6.3V; TC: X5R; Tolerance: ±20%; Part Number: CC0603_22UF_6.3V_20%_X5R; Component Kind: Standard; Component Type: Standard; Pin Count: 2; Value: 22uF; Status: None; Manufacturer Part Number: CC0603_22UF_6.3V_20%_X5R; Case: 0603; Mounted: Yes; Socket: No; SMD: Yes; Sense: No; Manufacturer1 Example: TDK; Manufacturer1 ComponentHeight: 1mm; HelpURL: \\cern.ch\dfs\Applications\Altium\Datasheets\CC0603_X5R_TDK_C.pdf; Author: CERN DEM JLC; CreateDate: 16.12.2013; LatestRevisionDate: 13.09.2016; ClassName: Artix
C206 C209 C211 = CC0805_4.7UF_10V_10%_X5R: Non-polarised capacitor; Part Description: SMD Multilayer Chip Ceramic Capacitor; Manufacturer: GENERIC; Manufacturer1 Part Number: 222224013672; Voltage: 10V; TC: X5R; Tolerance: ±10%; Part Number: CC0805_4.7UF_10V_10%_X5R; Component Kind: Standard; Component Type: Standard; Pin Count: 2; Value: 4.7uF; Status: Preferred; Manufacturer Part Number: CC0805_4.7UF_10V_10%_X5R; Case: 0805; Mounted: Yes; Socket: No; SMD: Yes; Sense: No; Manufacturer1 Example: PHYCOMP; Manufacturer1 ComponentHeight: 1.45mm; HelpURL: \\cern.ch\dfs\Applications\Altium\Datasheets\CC0805_X5R_PHYCOMP_HC.pdf; Author: CERN DEM JLC; CreateDate: 03.12.2007; LatestRevisionDate: 03.12.2007
C207 C208 = CC0402_22PF_50V_5%_C0G: Non-polarised capacitor; Part Description: SMD Multilayer Chip Ceramic Capacitor; Manufacturer: GENERIC; Manufacturer1 Part Number: C0402C220J5GACTU; Voltage: 50V; TC: C0G/NP0; Tolerance: ±5%; Part Number: CC0402_22PF_50V_5%_C0G; Component Kind: Standard; Component Type: Standard; Pin Count: 2; Value: 22pF; Status: Preferred; Manufacturer Part Number: CC0402_22PF_50V_5%_C0G; Case: 0402; Mounted: Yes; Socket: No; SMD: Yes; Sense: No; Manufacturer1 Example: KEMET; Manufacturer1 ComponentHeight: 0.55mm; HelpURL: \\cern.ch\dfs\Applications\Altium\Datasheets\CC0805_C0G_KEMET_(Commercial Grade).pdf; Author: CERN DEM JLC; CreateDate: 03.12.2007; LatestRevisionDate: 03.12.2007
C210 C212 = CC0201_100NF_6.3V_10%_X5R: Non-polarised capacitor; Part Description: SMD Multilayer Chip Ceramic Capacitor; Manufacturer: GENERIC; Manufacturer1 Part Number: 02016D104KAT2A; Voltage: 6.3V; TC: X5R; Tolerance: ±10%; Part Number: CC0201_100NF_6.3V_10%_X5R; Component Kind: Standard; Component Type: Standard; Pin Count: 2; Value: 100nF; Status: Not Recommended; Manufacturer Part Number: CC0201_100NF_6.3V_10%_X5R; Case: 0201; Mounted: Yes; Socket: No; SMD: Yes; Sense: No; Manufacturer1 Example: AVX; Manufacturer1 ComponentHeight: 0.33mm; HelpURL: \\cern.ch\dfs\Applications\Altium\Datasheets\CC0201_X5R_AVX.pdf; Author: CERN DEM JLC; CreateDate: 03.12.2007; LatestRevisionDate: 03.12.2007
C213-C224 C293 C409 = CC0402_100NF_16V_10%_X7R: Non-polarised capacitor; Part Description: SMD Multilayer Chip Ceramic Capacitor; Manufacturer: GENERIC; Manufacturer1 Part Number: GRM155R71C104KA88D; Voltage: 16V; TC: X7R; Tolerance: ±10%; Part Number: CC0402_100NF_16V_10%_X7R; Component Kind: Standard; Component Type: Standard; Pin Count: 2; Value: 100nF; Status: Not Recommended; Manufacturer Part Number: CC0402_100NF_16V_10%_X7R; Case: 0402; Mounted: Yes; Socket: No; SMD: Yes; Sense: No; Manufacturer1 Example: MURATA; Manufacturer1 ComponentHeight: 0.55mm; HelpURL: \\cern.ch\dfs\Applications\Altium\Datasheets\CC0402_X7R_MURATA_GRM.pdf; Author: CERN DEM JLC; CreateDate: 05/12/2013; LatestRevisionDate: 03/12/2007
D2 = PRTR5V0U2X: Ultra Low Capacitance Double Rail-to-Rail ESD Protection Diode; Part Description: Ultra Low Capacitance (1pF) Double Rail-to-Rail ESD Protection Diode (8kV); Manufacturer: NXP SEMICONDUCTORS; Voltage: 5.5V; PressFit: No; Bonding: No; Part Number: PRTR5V0U2X; Component Kind: Standard; Component Type: Standard; Device: PRTR5V0U2X; PackageDescription: SOT143B, SOT, 1.90mm Pitch; 4 Pin, 1.30mm W X 2.90mm L X 1.10mm H body, IPC Medium Density; Manufacturer Part Number: PRTR5V0U2X; Pin Count: 4; Case: SOT143B; Mounted: Yes; Socket: No; SMD: Yes; Sense: No; ComponentHeight: 1.1mm; HelpURL: \\cern.ch\dfs\Applications\Altium\Datasheets\PRTR5V0U2X.pdf; Author: CERN DEM JLC; CreateDate: 22.03.2011; LatestRevisionDate: 22.03.2011
IC17 IC19 IC20 = SN74AVC2T245RSWR: Dual-Bit Dual-Supply Bus Transceiver With Configurable Voltage Translation and 3-State Outputs; Manufacturer: TEXAS INSTRUMENTS; PressFit: No; Bonding: No; Part Number: SN74AVC2T245RSWR; Component Kind: Standard; Component Type: Standard; Device: SN74AVC2T245RSWR; PackageDescription: QFN, 0.40mm Pitch, Rect.;10 Pin, 1.80mm L X 1.40mm W X 0.55mm H Body, IPC Medium Density; Status: Not Recommended; Part Description: Dual-Bit Dual-Supply Bus Transceiver With Configurable Voltage Translation and 3-State Outputs; Manufacturer Part Number: SN74AVC2T245RSWR; Pin Count: 10; Case: QFN10; Mounted: Yes; Socket: No; SMD: Yes; Sense: No; ComponentHeight: 0.55mm; Author: CERN DEM JLC; HelpURL: \\cern.ch\dfs\Applications\Altium\Datasheets\SN74AVC2T245RSWR.pdf; CreateDate: 07.07.2014; LatestRevisionDate: 30.03.2017
IC18 = FT4232H-56Q: Quad High Speed USB to Multipurpose UART/MPSSE IC; Manufacturer: FUTURE TECHNOLOGY DEVICES INTERNATIONAL (FTDI); PressFit: No; Bonding: No; Part Number: FT4232H-56Q; Component Kind: Standard; Component Type: Standard; Device: FT4232H-56Q; PackageDescription: QFN, 0.50mm Pitch, Square; 56 Pin, 8.00mm L X 8.00mm W X 1.00mm H body (6.1mm X 6.1mm Thermal tab), IPC Medium Density; Part Description: Quad High Speed USB to Multipurpose UART/MPSSE IC; Manufacturer Part Number: FT4232H-56Q; Pin Count: 57; Case: QFN56; Mounted: Yes; Socket: No; SMD: Yes; Sense: No; ComponentHeight: 1mm; Author: CERN DEM JLC; HelpURL: \\cern.ch\dfs\Applications\Altium\Datasheets\FT4232H-56Q.pdf; CreateDate: 11.10.2016; LatestRevisionDate: 11.10.2016
IC21 = 93LC56B-I/OT: 2K Microwire Compatible Serial EEPROM; Part Description: 2K, 128X16-bit, 2.5V Microwire Compatible Serial EEPROM; Manufacturer: MICROCHIP TECHNOLOGY; PressFit: No; Bonding: No; Part Number: 93LC56B-I/OT; Component Kind: Standard; Component Type: Standard; Device: 93LC56B-I/OT; PackageDescription: SOT, 0.95mm Pitch; 6 Pin,1.55mm W X 2.90mm L X 1.45mm H body, IPC Medium Density; Manufacturer Part Number: 93LC56B-I/OT; Pin Count: 6; Case: SOT23-6; Mounted: Yes; Socket: No; SMD: Yes; Sense: No; ComponentHeight: 1.45mm; HelpURL: \\cern.ch\dfs\Applications\Altium\Datasheets\93LC56B-IOT.pdf; Author: CERN DEM BC; CreateDate: 06.04.2018; LatestRevisionDate: 06.04.2018
IC22 = PCA9306DCTR: Dual Bidirectional I2C Bus And SMBus Voltage-Level Translator; Manufacturer: TEXAS INSTRUMENTS; PressFit: No; Bonding: No; Part Number: PCA9306DCTR; Component Kind: Standard; Component Type: Standard; Device: PCA9306DCTR; PackageDescription: SOP, 0.65mm, Pitch; 8 Pin, 2.80mm W X 2.95mm L X 1.30mm H Body, PC Medium Density; Part Description: Dual Bidirectional I2C Bus And SMBus Voltage-Level Translator; Manufacturer Part Number: PCA9306DCTR; Pin Count: 8; Case: SSOP8; Mounted: Yes; Socket: No; SMD: Yes; Sense: No; ComponentHeight: 1.3mm; Author: CERN DEM JLC; HelpURL: \\cern.ch\dfs\Applications\Altium\Datasheets\PCA9306DCTR.pdf; CreateDate: 25.02.2013; LatestRevisionDate: 11.02.2016
IC26 = MIC5219-3.3YM5: 500mA Peak Output LDO Regulator; Part Description: 3.3V 500mA Peak Output Low Drop-Out  (LDO) Regulator; Manufacturer: MICROCHIP TECHNOLOGY; PressFit: No; Bonding: No; Part Number: MIC5219-3.3YM5; Component Kind: Standard; Component Type: Standard; Device: MIC5219-3.3YM5; PackageDescription: SOT, 0.95mm pitch; 5 pin, 1.60mm W X 2.90mm L X 1.45mm H body, IPC Medium Density; Manufacturer Part Number: MIC5219-3.3YM5; Pin Count: 5; Case: SOT23-5; Mounted: Yes; Socket: No; SMD: Yes; Sense: No; ComponentHeight: 1.45mm; HelpURL: \\cern.ch\dfs\Applications\Altium\Datasheets\MIC5219-3.3YM5.pdf; Author: CERN DEM WB; CreateDate: 2019-04-16; LatestRevisionDate: 2019-04-16
J23 = HIROSE_ZX62RD-AB-5P8: 5 Pin + 1 Shield USB Receptacle; Part Description: Micro-USB 2.0 Right Angle, SMD Type AB - Reverse (Top mount), Shell Through Hole; Manufacturer: HIROSE (HRS); PressFit: No; Part Number: HIROSE_ZX62RD-AB-5P8; Component Kind: Standard; Component Type: Standard; Pin Count: 7; Family: Micro-USB AB 2.0; Mounted: Yes; Socket: No; SMD: Yes; Sense: No; Status: Obsolete; Manufacturer Part Number: ZX62RD-AB-5P8; ComponentHeight: 2.35mm; HelpURL: \\cern.ch\dfs\Applications\Altium\Datasheets\HIROSE_ZX62RD-AB-5P8.pdf; ComponentLink1URL: \\cern.ch\dfs\Applications\Altium\Datasheets\HIROSE_ZX62RD-AB-5P8_Package-Drawing.pdf; ComponentLink1Description: Package-Drawing; Author: CERN DEM JLC; CreateDate: 29.10.2014; LatestRevisionDate: 22.06.2017
J24 = SAMTEC_TSW-105-07-L-D-LL: Connector 10 Male; Part Description: 10 Contacts, Pitch 2.54mm, Dual Row Through Mount  Straight Header With Locking Lead (Lead Length 2.54mm); Manufacturer: SAMTEC; PressFit: No; Part Number: SAMTEC_TSW-105-07-L-D-LL; Component Kind: Standard; Component Type: Standard; Pin Count: 10; Family: Header 10; Mounted: Yes; Socket: No; SMD: No; Sense: No; Status: None; Manufacturer Part Number: TSW-105-07-L-D-LL; ComponentHeight: 8.38mm; HelpURL: \\cern.ch\dfs\Applications\Altium\Datasheets\SAMTEC_TSW-105-07-L-D-LL.pdf; Author: CERN DEM JLC; CreateDate: 2012-01-23; LatestRevisionDate: 2012-07-26
L22 L24 L25 = IND0603_MURATA_BLM18SG121TN1D: Inductor; Part Description: SMD EMIFIL Suppression Chip Ferrite Bead; Manufacturer: MURATA; Power: 3A; Resistance: 0.025R; Tolerance: ±25%; Part Number: IND0603_MURATA_BLM18SG121TN1D; Component Kind: Standard; Component Type: Standard; Pin Count: 2; Value: 120R@100MHz; Status: None; Manufacturer Part Number: BLM18SG121TN1D; Case: 0603; Mounted: Yes; Socket: No; SMD: Yes; Sense: No; ComponentHeight: 0.65mm; HelpURL: \\cern.ch\dfs\Applications\Altium\Datasheets\IND0603_MURATA_BLM18S.pdf; Author: CERN DEM JLC; CreateDate: 23.07.2014; LatestRevisionDate: 23.07.2014
Q2 = XTAL_12MHZ_TXC_7M-12.000MAAJ-T: Crystal 4 pins 1=XTAL Control 2=GND3=XTAL 4=GND; Part Description: ±30ppm 18pF -20°C to +70°C  4 Pins, 3.2x2.5X0.8mm, SMD Sealing Crystal, 7M Series; Manufacturer: TXC CORPORATION; PressFit: No; Bonding: No; Part Number: XTAL_12MHZ_TXC_7M-12.000MAAJ-T; Component Kind: Standard; Component Type: Standard; PackageDescription: 4 Pins, 2.5x3.2mm, SMD Sealing Crystal, 7M Serie; Value: 12MHz; Manufacturer Part Number: 7M-12.000MAAJ-T; Pin Count: 4; Mounted: Yes; Socket: No; SMD: Yes; Sense: No; ComponentHeight: 0.8mm; HelpURL: \\cern.ch\dfs\Applications\Altium\Datasheets\XTAL_TXC_7M.pdf; Author: CERN DEM JLC; CreateDate: 19.06.2012; LatestRevisionDate: 19.06.2012
R194-R198 R201-R204 R206 R207 R209 = R0402_10K_1%_0.0625W_100PPM: Resistor - 1%; Part Description: General Purpose Thick Film Chip Resistor; Manufacturer: GENERIC; Manufacturer1 Part Number: 232270671003L; TC: ±100ppm/°C; PressFit: No; Part Number: R0402_10K_1%_0.0625W_100PPM; Component Kind: Standard; Component Type: Standard; Pin Count: 2; Value: 10k; Status: Not Recommended; Power: 0.0625W; Tolerance: ±1%; Manufacturer Part Number: R0402_10K_1%_0.0625W_100PPM; Case: 0402; Mounted: Yes; Socket: No; SMD: Yes; Manufacturer1 Example: YAGEO PHYCOMP; Manufacturer1 ComponentHeight: 0.4mm; HelpURL: \\cern.ch\dfs\Applications\Altium\Datasheets\R0402_Phycomp_RC0402.pdf; Author: CERN DEM JLC; CreateDate: 03.12.2007; LatestRevisionDate: 17.10.2012; Sense: No
R199 = R0402_12K_1%_0.0625W_100PPM: Resistor - 1%; Part Description: General Purpose Thick Film Chip Resistor; Manufacturer: GENERIC; Manufacturer1 Part Number: 232270671203L; TC: ±100ppm/°C; PressFit: No; Part Number: R0402_12K_1%_0.0625W_100PPM; Component Kind: Standard; Component Type: Standard; Pin Count: 2; Value: 12k; Status: Not Recommended; Power: 0.0625W; Tolerance: ±1%; Manufacturer Part Number: R0402_12K_1%_0.0625W_100PPM; Case: 0402; Mounted: Yes; Sense: No; Socket: No; SMD: Yes; Manufacturer1 Example: YAGEO PHYCOMP; Manufacturer1 ComponentHeight: 0.4mm; HelpURL: \\cern.ch\dfs\Applications\Altium\Datasheets\R0402_Phycomp_RC0402.pdf; Author: CERN DEM JLC; CreateDate: 03.12.2007; LatestRevisionDate: 17.10.2012
R200 R205 R208 = R0402_2K2_1%_0.0625W_100PPM: Resistor - 1%; Part Description: General Purpose Thick Film Chip Resistor; Manufacturer: GENERIC; Manufacturer1 Part Number: 232270672202L; TC: ±100ppm/°C; PressFit: No; Part Number: R0402_2K2_1%_0.0625W_100PPM; Component Kind: Standard; Component Type: Standard; Pin Count: 2; Value: 2k2; Status: Not Recommended; Power: 0.0625W; Tolerance: ±1%; Manufacturer Part Number: R0402_2K2_1%_0.0625W_100PPM; Case: 0402; Mounted: Yes; Sense: No; Socket: No; SMD: Yes; Manufacturer1 Example: YAGEO PHYCOMP; Manufacturer1 ComponentHeight: 0.4mm; HelpURL: \\cern.ch\dfs\Applications\Altium\Datasheets\R0402_Phycomp_RC0402.pdf; Author: CERN DEM JLC; CreateDate: 03.12.2007; LatestRevisionDate: 17.10.2012
R241 = R0402_200K_1%_0.0625W_100PPM: Resistor - 1%; Part Description: General Purpose Thick Film Chip Resistor; Manufacturer: GENERIC; Manufacturer1 Part Number: 232270672004L; TC: ±100ppm/°C; PressFit: No; Part Number: R0402_200K_1%_0.0625W_100PPM; Component Kind: Standard; Component Type: Standard; Pin Count: 2; Value: 200k; Status: Not Recommended; Power: 0.0625W; Tolerance: ±1%; Manufacturer Part Number: R0402_200K_1%_0.0625W_100PPM; Case: 0402; Mounted: Yes; Sense: No; Socket: No; SMD: Yes; Manufacturer1 Example: YAGEO PHYCOMP; Manufacturer1 ComponentHeight: 0.4mm; HelpURL: \\cern.ch\dfs\Applications\Altium\Datasheets\R0402_Phycomp_RC0402.pdf; Author: CERN DEM JLC; CreateDate: 03.12.2007; LatestRevisionDate: 17.10.2012
T13 T14 = BSH103: N-CHANNEL MOSFET WITH DIODE; Part Description: 30V 850mA N-Channel Enhancement Mode Field-Effect Transistor; Manufacturer: NEXPERIA; PressFit: No; Bonding: No; Part Number: BSH103; Component Kind: Standard; Component Type: Standard; Device: BSH103; PackageDescription: SOT23, 3 pin, Pitch 0.95mm - 1.3mm W X 2.9mm L X 1.1mm H, IPC Medium Density; Manufacturer Part Number: BSH103; Pin Count: 3; Case: SOT23-3; Mounted: Yes; Socket: No; SMD: Yes; Sense: No; ComponentHeight: 1.1mm; HelpURL: \\cern.ch\dfs\Applications\Altium\Datasheets\BSH103.pdf; Author: CERN DEM JLC; CreateDate: 16.03.2010; LatestRevisionDate: 20.06.2017
TP15-TP19 = SMD_PAD_1.27X1.27MM: Part Description: 1.27mm x 1.27mm PCB Copper Area (SMD Test Point); Mounted: No; Part Number: SMD_PAD_1.27X1.27MM; Component Type: Standard (No BOM); Pin Count: 1; Family: Test Point; Socket: No; SMD: Yes; Sense: No; Status: None; ComponentHeight: 0mm; HelpURL: Undefined; Author: CERN DEM JLC; CreateDate: 12.01.2008; LatestRevisionDate: 12.01.2008; PackageDescription: 1.27mm x 1.27mm PCB Copper Area (SMD Test Point)